# Altium schematic sheet fet.SchDoc: H Bridge
size A4; Address4: Niklas Fauth; Revision: V1.0; SheetNumber: 4; SheetTotal: 5
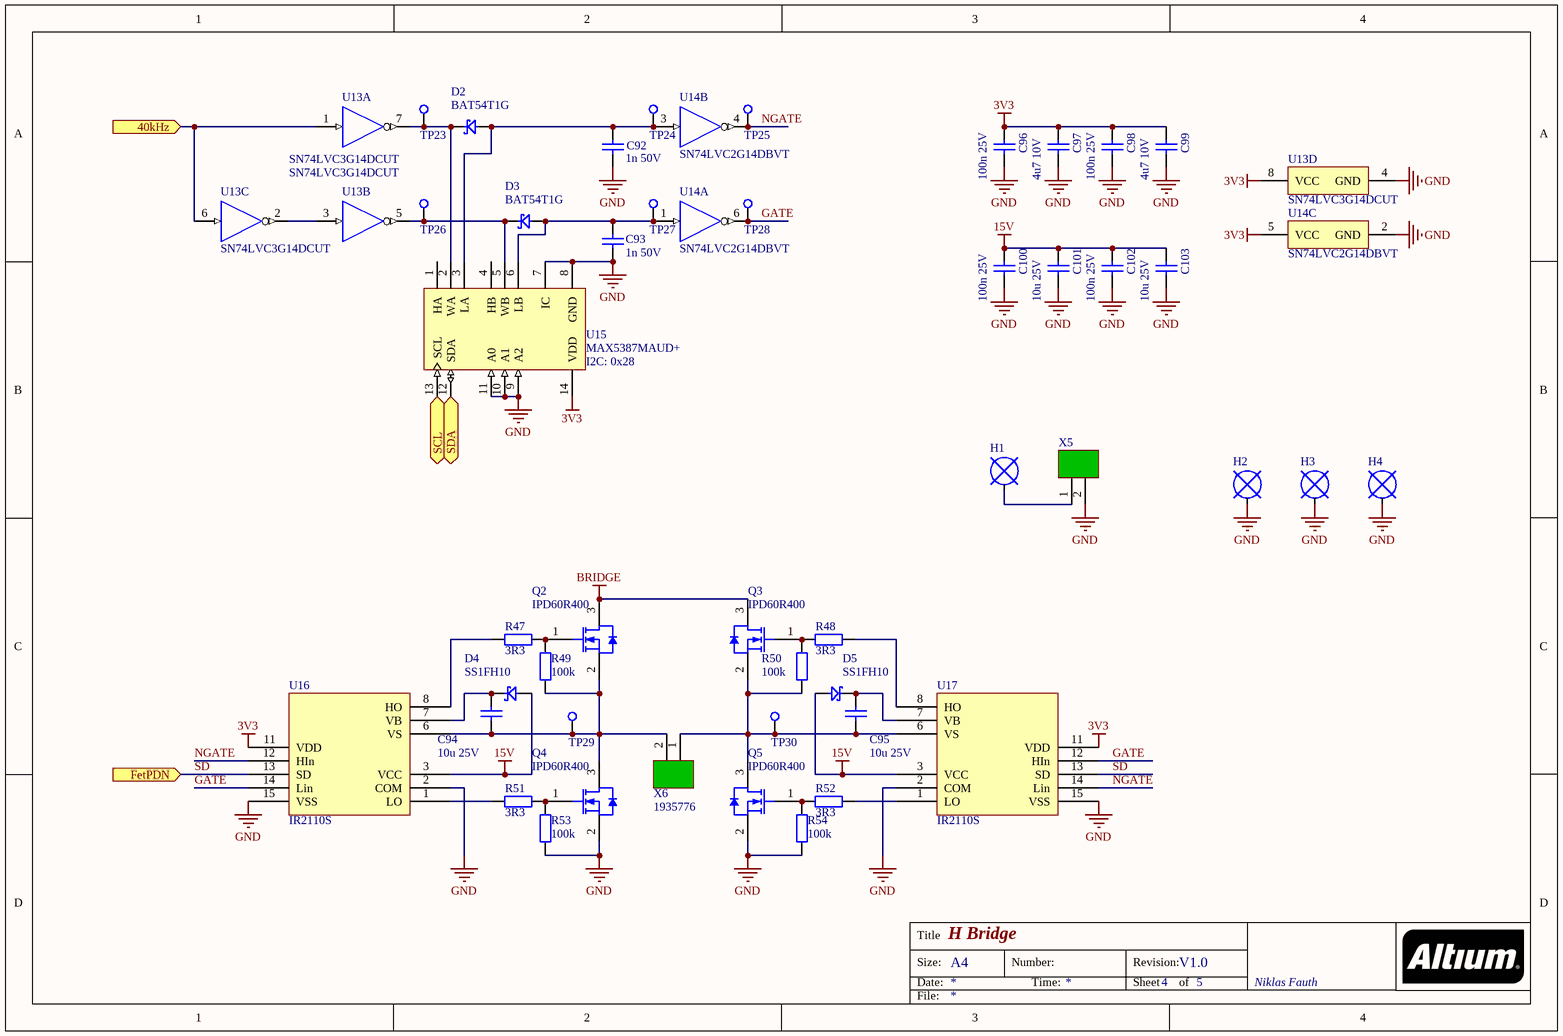
[diagram p0: fet.SchDoc]

## Parts
C92  1n 50V  [C-0603-H]
C93  1n 50V  [C-0603-H]
C94  10u 25V  [C-0805-H]
C95  10u 25V  [C-0805-H]
C96  100n 25V  [C-0603-H]
C97  4u7 10V  [C-0603-H]
C98  100n 25V  [C-0603-H]
C99  4u7 10V  [C-0603-H]
C100  100n 25V  [C-0603-H]
C101  10u 25V  [C-0805-H]
C102  100n 25V  [C-0603-H]
C103  10u 25V  [C-0805-H]
D2  BAT54T1G  [SOD123]
D3  BAT54T1G  [SOD123]
D4  SS1FH10  [DO-219AB (SMF)]
D5  SS1FH10  [DO-219AB (SMF)]
H1  WE-ST-5MM-F  [WE-Standoff-5MM-M3-Female]  (value not drawn)
H2  WE-ST-5MM-F  [WE-Standoff-5MM-M3-Female]  (value not drawn)
H3  WE-ST-5MM-F  [WE-Standoff-5MM-M3-Female]  (value not drawn)
H4  WE-ST-5MM-F  [WE-Standoff-5MM-M3-Female]  (value not drawn)
Q2  IPD60R400  [TO-252]
Q3  IPD60R400  [TO-252]
Q4  IPD60R400  [TO-252]
Q5  IPD60R400  [TO-252]
R47  3R3  [R-0603-H]
R48  3R3  [R-0603-H]
R49  100k  [R-0603-M]
R50  100k  [R-0603-M]
R51  3R3  [R-0603-H]
R52  3R3  [R-0603-H]
R53  100k  [R-0603-M]
R54  100k  [R-0603-M]
TP23  TP-SMD  [TP]  (value not drawn)
TP24  TP-SMD  [TP]  (value not drawn)
TP25  TP-SMD  [TP]  (value not drawn)
TP26  TP-SMD  [TP]  (value not drawn)
TP27  TP-SMD  [TP]  (value not drawn)
TP28  TP-SMD  [TP]  (value not drawn)
TP29  TP-SMD  [TP]  (value not drawn)
TP30  TP-SMD  [TP]  (value not drawn)
U13  SN74LVC3G14DCUT  [DCU0008A_N]  (parts A,B,C,D of 4)
U14  SN74LVC2G14DBVT  [DBV0006A_N]  (parts A,B,C of 3)
U15  MAX5387MAUD+  [MAXM-U14+1_N]
U16  IR2110S  [SOIC127P1030X265-16N]
U17  IR2110S  [SOIC127P1030X265-16N]
X5  1935776  [PHOENIX-2P-5mm]  (value not drawn)
X6  1935776  [PHOENIX-2P-5mm]

## Ports
40kHz (in), FetPDN (in), SCL (in), SDA (bidir)

## Nets
3V3: C96.2 C97.2 C98.2 C99.2 U13.8(VCC) U14.5(VCC) U15.14(VDD) U16.11(VDD) U17.11(VDD)
15V: C100.2 C101.2 C102.2 C103.2 D4.1(an) D5.1(an) U16.3(VCC) U17.3(VCC)
BRIDGE: Q2.3 Q3.3
GND: C92.1 C93.1 C96.1 C97.1 C98.1 C99.1 C100.1 C101.1 C102.1 C103.1 H2.0(GND) H3.0(GND) H4.0(GND) Q4.2 Q5.2 R53.1 R54.1 U13.4(GND) U14.2(GND) U15.7(IC) U15.8(GND) U15.9(A2) U15.10(A1) U15.11(A0) U16.2(COM) U16.15(VSS) U17.2(COM) U17.15(VSS) X5.2(GND)
40kHz: U13.1(1A) U13.6(3A) ; port 40kHz
GATE: TP28.1 U14.6(1Y) U16.14(Lin) U17.12(HIn)
NGATE: TP25.1 U14.4(2Y) U16.12(HIn) U17.14(Lin)
SCL: U15.13(SCL) ; port SCL
SD: U16.13(SD) U17.13(SD) ; port FetPDN
SDA: U15.12(SDA) ; port SDA
NetC92_2: C92.2 D2.1(an) TP24.1 U14.3(2A) U15.3(LA)
NetC93_2: C93.2 D3.1(an) TP27.1 U14.1(1A) U15.6(LB)
NetC94_1: C94.1 Q2.2 Q4.3 R49.1 TP29.1 U16.6(VS) X6.2(GND)
NetC94_2: C94.2 D4.2(kt) U16.7(VB)
NetC95_1: C95.1 Q3.2 Q5.3 R50.1 TP30.1 U17.6(VS) X6.1(GND)
NetC95_2: C95.2 D5.2(kt) U17.7(VB)
NetD2_2: D2.2(kt) TP23.1 U13.7(1Y) U15.2(WA)
NetD3_2: D3.2(kt) TP26.1 U13.5(2Y) U15.5(WB)
NetH1_0: H1.0(GND) X5.1(GND)
NetQ2_1: Q2.1 R47.2 R49.2
NetQ3_1: Q3.1 R48.2 R50.2
NetQ4_1: Q4.1 R51.2 R53.2
NetQ5_1: Q5.1 R52.2 R54.2
NetR47_1: R47.1 U16.8(HO)
NetR48_1: R48.1 U17.8(HO)
NetR51_1: R51.1 U16.1(LO)
NetR52_1: R52.1 U17.1(LO)
NetU13_2: U13.2(3Y) U13.3(2A)

Not connected (* = marked no-connect by the designer): U15 1(HA) 4(HB)

## Notes on the sheet
- (near U15) I2C: 0x28
- Title
- Size:
- Date:
- A4
- Number:
- Time:
- Revision:
- Sheet
- of
- File:

## Library data of the parts
C92 C93 = C-0603-1n-50V: Capacitor 1nF 50V; Supplier 1: Mouser; Supplier Part Number 1: 80-C0603C102J5G
C94 C95 C101 C103 = C-0805-10u-25V: Capacitor 10u 25V; Supplier 1: Mouser; Supplier Part Number 1: 80-C0805C106K3P
C96 C98 C100 C102 = C-0603-100n-25V: Capacitor 100n 25V; Supplier 1: Mouser; Supplier Part Number 1: 80-C0603C104K3R
C97 C99 = C-0603-4u7-10V: Capacitor 4.7uF 10V; Supplier 1: Mouser; Supplier Part Number 1: 80-C0603C475K8P
D2 D3 = D-BAT54T1G: Supplier 1: Mouser; Supplier Part Number 1: 863-BAT54T1G
D4 D5 = D-SS1FH10: Supplier 1: Mouser; Supplier Part Number 1: 78-SS1FH10HM3/H
H1-H4 = WE-Standoff-M3-5MM-Female: Supplier 1: Mouser; Supplier Part Number 1: 710-9774050360R
Q2-Q5 = MOSFET-IPD60R400: Supplier 1: Mouser; Supplier Part Number 1: IPD60R400CEATMA1
R47 R48 R51 R52 = R-0603-3R3: Resistor 3R3; Supplier 1: Mouser; Supplier Part Number 1: 71-CRCW06033R30FKEA
R49 R50 R53 R54 = R-0603-100k: Resistor 100k; Supplier 1: Mouser; Supplier Part Number 1: 71-CRCW0603-100K-E3
U13 = CMP-0859-00634-3: Triple Schmitt-Trigger Inverter, DCU0008A, SMALL T&R; Manufacturer: Texas Instruments; ICC @ Nom Voltage(Max)(mA): 0.01; Output Drive (IOL/IOH)(Max)(mA): 32/-32; Logic: Inverting; VCC(Max)(V): 5.5; Technology Family: LVC; Output Type: CMOS; tpd @ Nom Voltage(Max)(ns): 9.2,5.7,5.4,4.3; VCC(Min)(V): 1.65; Sub-Family: Inverting Buffer/Driver; Rating: Catalog; 3-State Output: No; Bits(#): 3; F @ Nom Voltage(Max)(Mhz): 150; Voltage(Nom)(V): 1.8,2.5,3.3,5; Input Type: CMOS/TTL; Schmitt Trigger: Yes; PackageReference: DCU0008A; DatasheetVersion: SCES367J; Operating Temperature Range(C): -40 to 125; Generic Part Number: SN74LVC3G14; PartId: 1
U14 = CMP-0859-00239-3: Dual Schmitt-Trigger Inverter, DBV0006A, SMALL T&R; Manufacturer: Texas Instruments; ICC @ Nom Voltage(Max)(mA): 0.01; Logic: Inverting; Sub-Family: Inverting Buffer/Driver; tpd @ Nom Voltage(Max)(ns): 9.5,5.7,5.4,4.3; Technology Family: LVC; VCC(Max)(V): 5.5; Input Type: CMOS/TTL; Bits(#): 2; F @ Nom Voltage(Max)(Mhz): 150; Voltage(Nom)(V): 1.8,2.5,3.3,5; Output Type: CMOS; VCC(Min)(V): 1.65; 3-State Output: No; Schmitt Trigger: Yes; Rating: Catalog; Output Drive (IOL/IOH)(Max)(mA): 32/-32; Generic Part Number: SN74LVC2G14; PackageReference: DBV0006A; DatasheetVersion: SCES200M; Operating Temperature Range(C): -40 to 125; PartId: 1
U15 = CMP-0022-00051-1: Dual, Low-Voltage Digital Potentiometer with I2C Control Interface, Volatile, Linear Taper, 256 Steps, -40 to 125 degC, 14-pin TSSOP (U14+1), Pb-Free; PartNumber: MAX5387MAUD+; ComponentLink1Description: Manufacturer URL; ComponentLink1URL: http://www.maximintegrated.com/; Code_JEDEC: MO-153; ComponentLink2Description: Datasheet; PackageReference: U14+1; Applications: Low-Voltage Battery Applications, Portable Consumer; Control Interface: I2C; ComponentLink3Description: Package Specification; Mounting Technology: Surface Mount; PackageDescription: 14-Pin Thin Shrink Small-Outline Package (U14+1), Body 5 x 4.4 mm, Pitch 0.65 mm; ComponentLink2URL: http://datasheets.maximintegrated.com/en/ds/MAX5387.pdf; PackageVersion: Rev. L, 07/2010; DatasheetVersion: Rev. 2; ComponentLink3URL: http://pdfserv.maximintegrated.com/package_dwgs/21-0066.PDF
X5 X6 = PHOENIX-2P-5MM: Supplier 1: Mouser; Supplier Part Number 1: 651-1935776